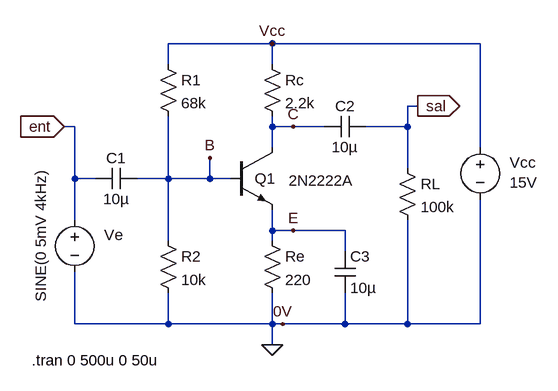
[diagram p0: schematic E8-amplificador-EC.asc]
E8-amplificador-EC.asc, the LTspice schematic file:
Version 4
SHEET 1 1036 680
WIRE -512 -96 -672 -96
WIRE -192 -96 -512 -96
WIRE -672 -64 -672 -96
WIRE -512 -64 -512 -96
WIRE -288 0 -304 0
WIRE -816 32 -832 32
WIRE -512 32 -512 16
WIRE -480 32 -512 32
WIRE -432 32 -480 32
WIRE -304 32 -304 0
WIRE -304 32 -368 32
WIRE -512 64 -512 32
WIRE -192 64 -192 -96
WIRE -304 96 -304 32
WIRE -816 112 -816 32
WIRE -784 112 -816 112
WIRE -672 112 -672 16
WIRE -672 112 -720 112
WIRE -608 112 -608 80
WIRE -608 112 -672 112
WIRE -576 112 -608 112
WIRE -816 176 -816 112
WIRE -512 192 -512 160
WIRE -480 192 -512 192
WIRE -400 192 -480 192
WIRE -672 208 -672 112
WIRE -512 208 -512 192
WIRE -400 224 -400 192
WIRE -816 336 -816 256
WIRE -672 336 -672 288
WIRE -672 336 -816 336
WIRE -512 336 -512 288
WIRE -512 336 -672 336
WIRE -496 336 -512 336
WIRE -400 336 -400 288
WIRE -400 336 -496 336
WIRE -304 336 -304 176
WIRE -304 336 -400 336
WIRE -192 336 -192 144
WIRE -192 336 -304 336
WIRE -512 368 -512 336
FLAG -480 32 C
FLAG -480 192 E
FLAG -608 80 B
FLAG -512 368 0
FLAG -496 336 0V
FLAG -512 -96 Vcc
FLAG -288 0 sal
IOPIN -288 0 Out
FLAG -832 32 ent
IOPIN -832 32 In
SYMBOL npn -576 64 R0
WINDOW 0 37 48 Left 2
WINDOW 3 89 51 Left 2
SYMATTR InstName Q1
SYMATTR Value 2N2222A
SYMBOL voltage -192 48 R0
WINDOW 0 45 39 Left 2
WINDOW 3 45 70 Left 2
WINDOW 123 0 0 Left 0
WINDOW 39 0 0 Left 0
SYMATTR InstName Vcc
SYMATTR Value 15V
SYMBOL res -688 -80 R0
SYMATTR InstName R1
SYMATTR Value 68k
SYMBOL res -688 192 R0
SYMATTR InstName R2
SYMATTR Value 10k
SYMBOL res -528 -80 R0
SYMATTR InstName Rc
SYMATTR Value 2.2k
SYMBOL res -528 192 R0
SYMATTR InstName Re
SYMATTR Value 220
SYMBOL cap -416 224 R0
SYMATTR InstName C3
SYMATTR Value 10µ
SYMBOL cap -368 16 R90
WINDOW 0 0 32 VBottom 2
WINDOW 3 32 32 VTop 2
SYMATTR InstName C2
SYMATTR Value 10µ
SYMBOL cap -720 96 R90
WINDOW 0 0 32 VBottom 2
WINDOW 3 32 32 VTop 2
SYMATTR InstName C1
SYMATTR Value 10µ
SYMBOL voltage -816 160 R0
WINDOW 0 45 39 Left 2
WINDOW 3 -52 -61 VRight 2
WINDOW 123 0 0 Left 0
WINDOW 39 0 0 Left 0
SYMATTR InstName Ve
SYMATTR Value SINE(0 5mV 4kHz)
SYMBOL res -320 80 R0
SYMATTR InstName RL
SYMATTR Value 100k
TEXT -882 392 Left 2 !.tran 0 500u 0 50u

The netlist it stands for:
* E8-amplificador-EC.asc
Q1 C B E 0 2N2222A
Vcc Vcc 0 15V
R1 Vcc B 68k
R2 B 0 10k
Rc Vcc C 2.2k
Re E 0 220
C3 E 0 10µ
C2 sal C 10µ
C1 B ent 10µ
Ve ent 0 SINE(0 5mV 4kHz)
RL sal 0 100k
.model NPN NPN
.model PNP PNP
.lib standard.bjt
.tran 0 500u 0 50u
.backanno
.end

* Results of the author's LTspice run, read from the files saved beside the schematic
* Operating Point, zero values left out:
*   V(c) = 4.959 V
*   V(b) = 1.694 V
*   V(e) = 1.01 V
*   V(vcc) = 15 V
*   Ic(Q1) = 4.564 mA
*   Ib(Q1) = 26.22 µA
*   Ie(Q1) = -4.591 mA
*   I(Re) = 4.59 mA
*   I(Rc) = 4.564 mA
*   I(R2) = 169.4 µA
*   I(R1) = 195.7 µA
*   I(Vcc) = -4.76 mA